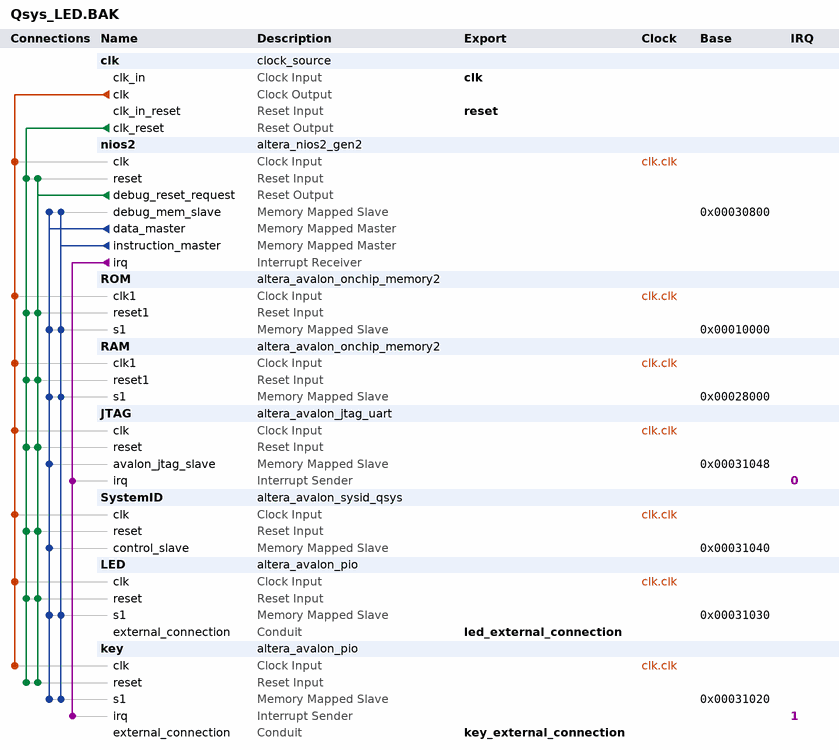
[diagram p0: system contents]
# Platform Designer (Qsys) system Qsys_LED.BAK, Cyclone V 5CSEMA5F31C6
# Parameters at their usual value, and those the tool derives, are not listed.
package require -exact qsys 17.0
create_system Qsys_LED.BAK
set_project_property DEVICE_FAMILY {Cyclone V}
set_project_property DEVICE 5CSEMA5F31C6

add_instance clk clock_source 17.0
set_instance_parameter_value clk clockFrequency 100000000

add_instance nios2 altera_nios2_gen2 17.0
set_instance_parameter_value nios2 dcache_size 2048
set_instance_parameter_value nios2 exceptionSlave RAM.s1
set_instance_parameter_value nios2 icache_size 4096
set_instance_parameter_value nios2 impl Fast
set_instance_parameter_value nios2 resetSlave ROM.s1

add_instance ROM altera_avalon_onchip_memory2 17.0
set_instance_parameter_value ROM dataWidth 32
set_instance_parameter_value ROM dualPort false
set_instance_parameter_value ROM initMemContent true
set_instance_parameter_value ROM initializationFileName onchip_mem.hex
set_instance_parameter_value ROM memorySize 40960
set_instance_parameter_value ROM writable false

add_instance RAM altera_avalon_onchip_memory2 17.0
set_instance_parameter_value RAM dataWidth 32
set_instance_parameter_value RAM dualPort false
set_instance_parameter_value RAM initMemContent true
set_instance_parameter_value RAM initializationFileName onchip_mem.hex
set_instance_parameter_value RAM memorySize 20480

add_instance JTAG altera_avalon_jtag_uart 17.0
set_instance_parameter_value JTAG simInteractiveOptions NO_INTERACTIVE_WINDOWS

add_instance SystemID altera_avalon_sysid_qsys 17.0
set_instance_parameter_value SystemID id 0

add_instance LED altera_avalon_pio 17.0
set_instance_parameter_value LED direction Output
set_instance_parameter_value LED width 10

add_instance key altera_avalon_pio 17.0
set_instance_parameter_value key bitClearingEdgeCapReg true
set_instance_parameter_value key captureEdge true
set_instance_parameter_value key direction Input
set_instance_parameter_value key generateIRQ true
set_instance_parameter_value key irqType EDGE
set_instance_parameter_value key width 1

# connections
add_connection clk.clk JTAG.clk clock
add_connection clk.clk key.clk clock
add_connection clk.clk LED.clk clock
add_connection clk.clk nios2.clk clock
add_connection clk.clk RAM.clk1 clock
add_connection clk.clk ROM.clk1 clock
add_connection clk.clk SystemID.clk clock
add_connection clk.clk_reset JTAG.reset reset
add_connection clk.clk_reset key.reset reset
add_connection clk.clk_reset LED.reset reset
add_connection clk.clk_reset nios2.reset reset
add_connection clk.clk_reset RAM.reset1 reset
add_connection clk.clk_reset ROM.reset1 reset
add_connection clk.clk_reset SystemID.reset reset
add_connection nios2.debug_reset_request JTAG.reset reset
add_connection nios2.debug_reset_request key.reset reset
add_connection nios2.debug_reset_request LED.reset reset
add_connection nios2.debug_reset_request nios2.reset reset
add_connection nios2.debug_reset_request RAM.reset1 reset
add_connection nios2.debug_reset_request ROM.reset1 reset
add_connection nios2.debug_reset_request SystemID.reset reset
add_connection nios2.data_master JTAG.avalon_jtag_slave avalon
set_connection_parameter_value nios2.data_master/JTAG.avalon_jtag_slave baseAddress 0x00031048
add_connection nios2.data_master key.s1 avalon
set_connection_parameter_value nios2.data_master/key.s1 baseAddress 0x00031020
add_connection nios2.data_master LED.s1 avalon
set_connection_parameter_value nios2.data_master/LED.s1 baseAddress 0x00031030
add_connection nios2.data_master nios2.debug_mem_slave avalon
set_connection_parameter_value nios2.data_master/nios2.debug_mem_slave baseAddress 0x00030800
add_connection nios2.data_master RAM.s1 avalon
set_connection_parameter_value nios2.data_master/RAM.s1 baseAddress 0x00028000
add_connection nios2.data_master ROM.s1 avalon
set_connection_parameter_value nios2.data_master/ROM.s1 baseAddress 0x00010000
add_connection nios2.data_master SystemID.control_slave avalon
set_connection_parameter_value nios2.data_master/SystemID.control_slave baseAddress 0x00031040
add_connection nios2.instruction_master key.s1 avalon
set_connection_parameter_value nios2.instruction_master/key.s1 baseAddress 0x00031020
add_connection nios2.instruction_master LED.s1 avalon
set_connection_parameter_value nios2.instruction_master/LED.s1 baseAddress 0x00031030
add_connection nios2.instruction_master nios2.debug_mem_slave avalon
set_connection_parameter_value nios2.instruction_master/nios2.debug_mem_slave baseAddress 0x00030800
add_connection nios2.instruction_master RAM.s1 avalon
set_connection_parameter_value nios2.instruction_master/RAM.s1 baseAddress 0x00028000
add_connection nios2.instruction_master ROM.s1 avalon
set_connection_parameter_value nios2.instruction_master/ROM.s1 baseAddress 0x00010000
add_connection nios2.irq JTAG.irq interrupt
set_connection_parameter_value nios2.irq/JTAG.irq irqNumber 0
add_connection nios2.irq key.irq interrupt
set_connection_parameter_value nios2.irq/key.irq irqNumber 1

# exported interfaces
add_interface clk clock sink
set_interface_property clk EXPORT_OF clk.clk_in
add_interface key_external_connection conduit end
set_interface_property key_external_connection EXPORT_OF key.external_connection
add_interface led_external_connection conduit end
set_interface_property led_external_connection EXPORT_OF LED.external_connection
add_interface reset reset sink
set_interface_property reset EXPORT_OF clk.clk_in_reset

set_interconnect_requirement {$system} qsys_mm.clockCrossingAdapter HANDSHAKE
set_interconnect_requirement {$system} qsys_mm.enableEccProtection FALSE
set_interconnect_requirement {$system} qsys_mm.insertDefaultSlave FALSE
set_interconnect_requirement {$system} qsys_mm.maxAdditionalLatency 1

save_system Qsys_LED.BAK.qsys
